# Altium schematic sheet 26_Clocks_2.SchDoc: Clocks 2
size A3; Organization: Lime Microsystems; Address1: Surrey Tech Centre; Address2: Guildford GU2 7YG; Address3: Surrey; Address4: United Kingdom; Revision: v1.2; SheetNumber: 24; SheetTotal: 27
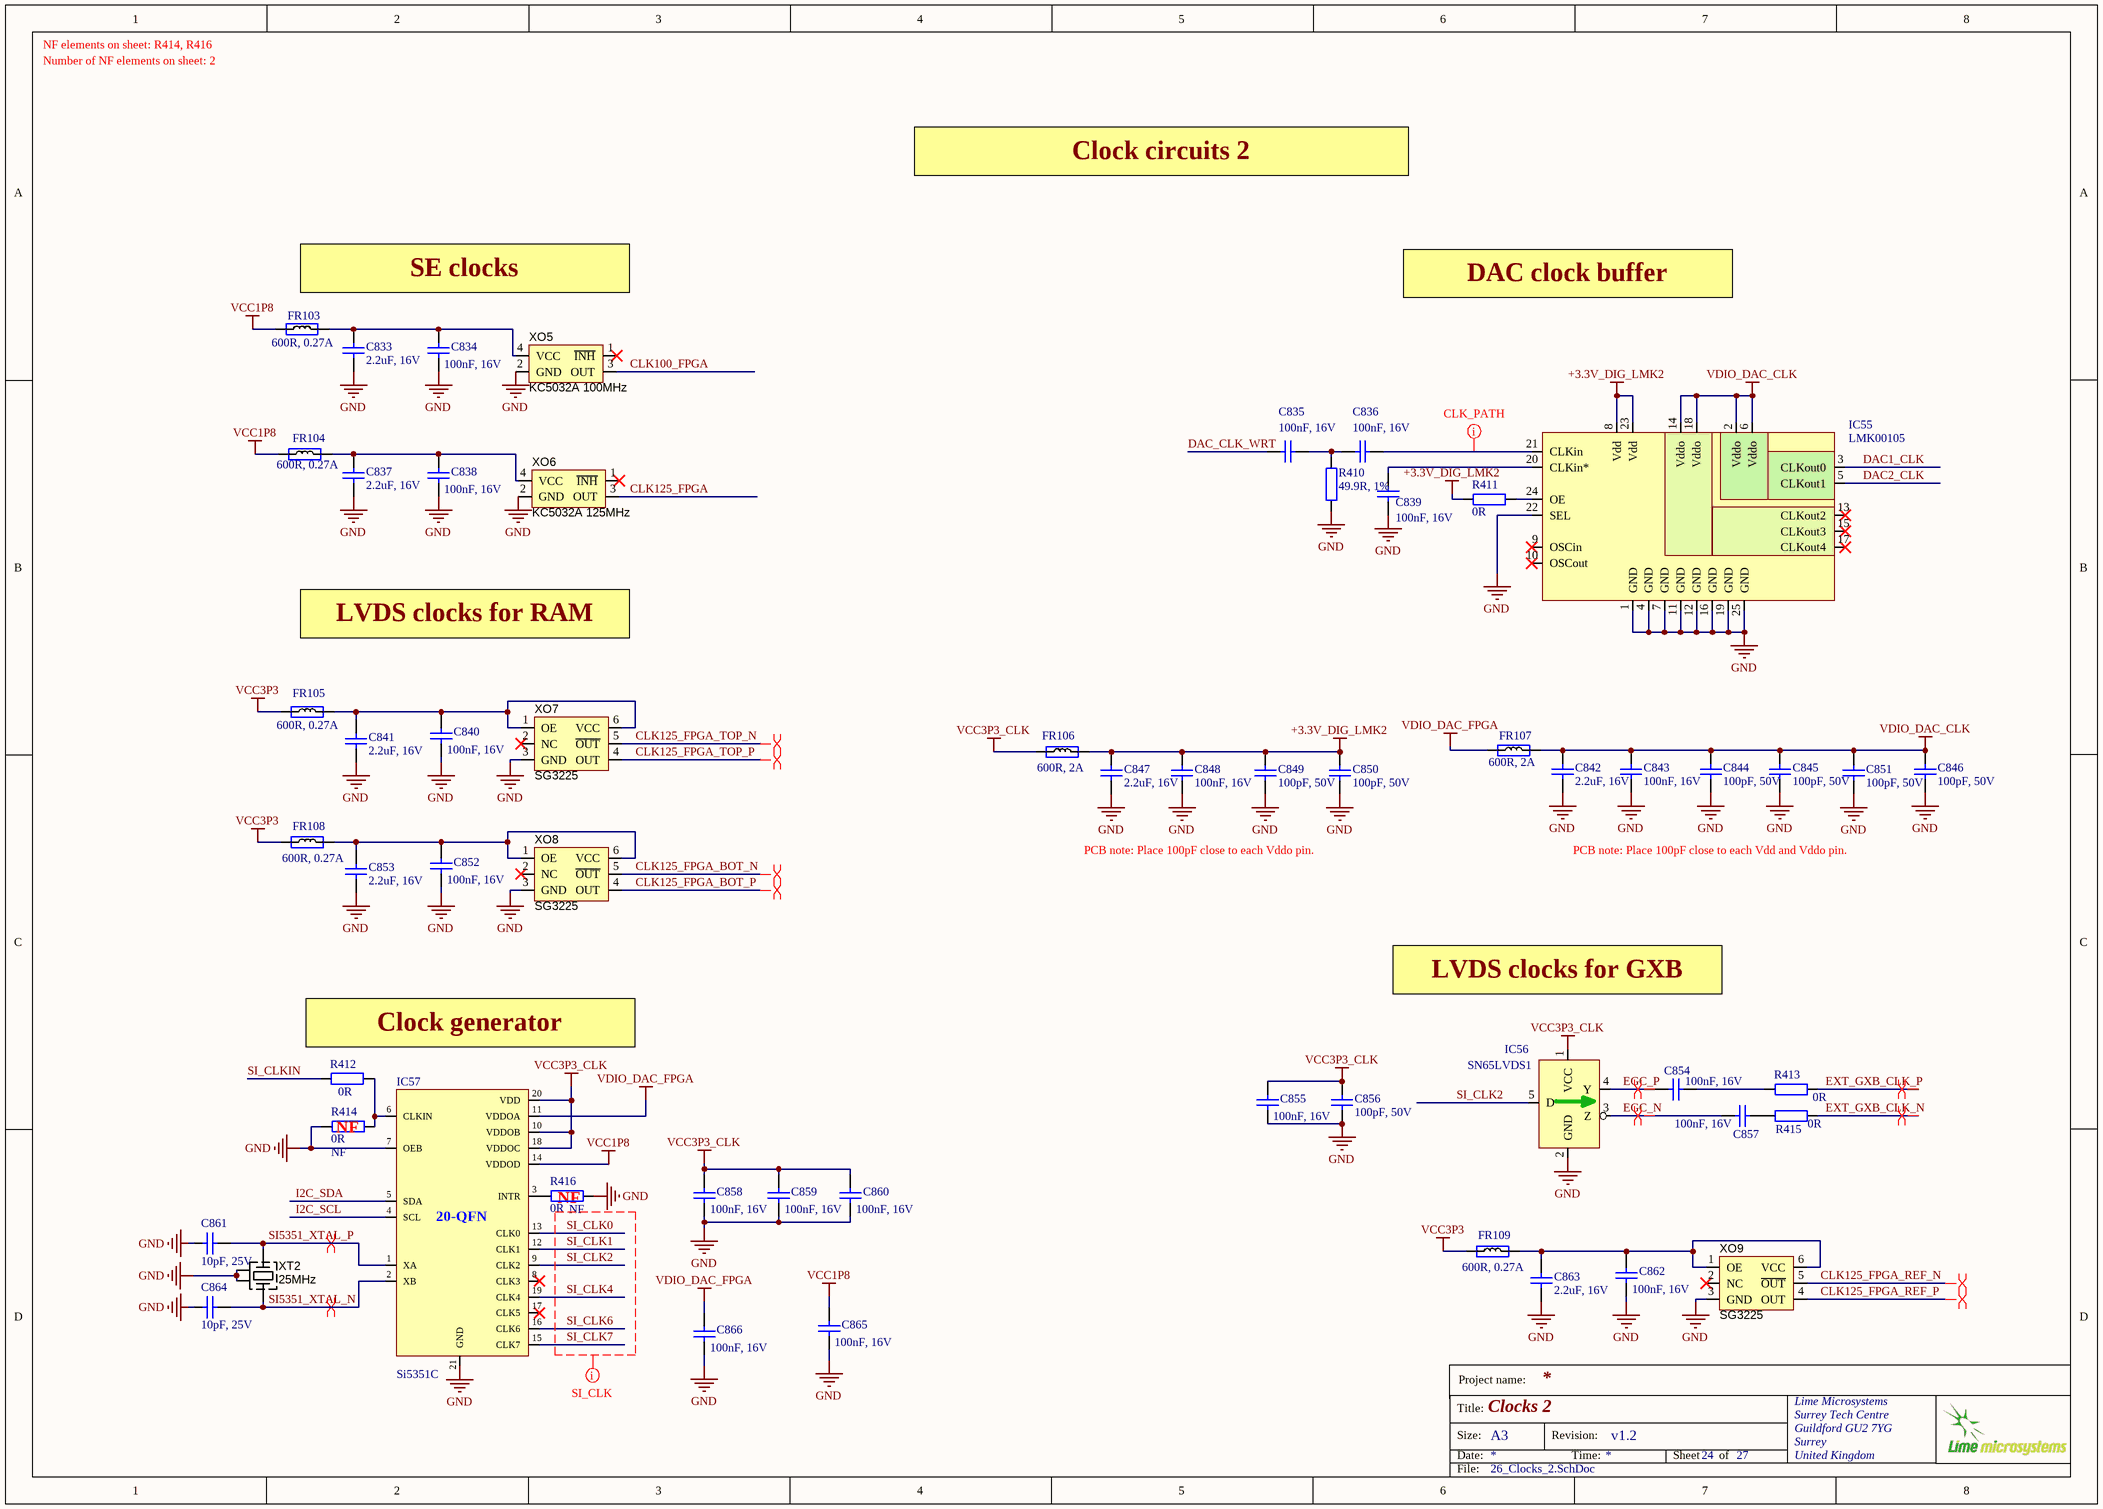
[diagram p0: 26_Clocks_2.SchDoc]

## Parts
C833  2.2uF, 16V  [CAP0402]
C834  100nF, 16V  [CAP0402]
C835  100nF, 16V  [CAP0402]
C836  100nF, 16V  [CAP0402]
C837  2.2uF, 16V  [CAP0402]
C838  100nF, 16V  [CAP0402]
C839  100nF, 16V  [CAP0402]
C840  100nF, 16V  [CAP0402]
C841  2.2uF, 16V  [CAP0402]
C842  2.2uF, 16V  [CAP0402]
C843  100nF, 16V  [CAP0402]
C844  100pF, 50V  [CAP0402]
C845  100pF, 50V  [CAP0402]
C846  100pF, 50V  [CAP0402]
C847  2.2uF, 16V  [CAP0402]
C848  100nF, 16V  [CAP0402]
C849  100pF, 50V  [CAP0402]
C850  100pF, 50V  [CAP0402]
C851  100pF, 50V  [CAP0402]
C852  100nF, 16V  [CAP0402]
C853  2.2uF, 16V  [CAP0402]
C854  100nF, 16V  [CAP0402]
C855  100nF, 16V  [CAP0402]
C856  100pF, 50V  [CAP0402]
C857  100nF, 16V  [CAP0402]
C858  100nF, 16V  [CAP0402]
C859  100nF, 16V  [CAP0402]
C860  100nF, 16V  [CAP0402]
C861  10pF, 25V  [CAP0402]
C862  100nF, 16V  [CAP0402]
C863  2.2uF, 16V  [CAP0402]
C864  10pF, 25V  [CAP0402]
C865  100nF, 16V  [CAP0402]
C866  100nF, 16V  [CAP0402]
FR103  value 600R, 0.27A  [RES0201]  (hidden comment: Ferrite)
FR104  value 600R, 0.27A  [RES0201]  (hidden comment: Ferrite)
FR105  value 600R, 0.27A  [RES0201]  (hidden comment: Ferrite)
FR106  600R, 2A  [RES0805]
FR107  600R, 2A  [RES0805]
FR108  value 600R, 0.27A  [RES0201]  (hidden comment: Ferrite)
FR109  value 600R, 0.27A  [RES0201]  (hidden comment: Ferrite)
IC55  LMK00105  [LMK00105SQ]
IC56  SN65LVDS1  [SOT23-5]
IC57  Si5351C  [Si5351C_20QFN]
R410  49.9R, 1%  [RES0402]
R411  0R  [RES0402]
R412  0R  [RES0402]
R413  0R  [RES0402]
R414  0R  Assembly Info: NF  [RES0402]
R415  0R  [RES0402]
R416  0R  Assembly Info: NF  [RES0402]
XO5  KC5032A 100MHz  [CRYSTAL_4-LCC_v4]
XO6  KC5032A 125MHz  [CRYSTAL_4-LCC_v4]
XO7  SG3225  [CRYSTAL_6-LCC]
XO8  SG3225  [CRYSTAL_6-LCC]
XO9  SG3225  [CRYSTAL_6-LCC]
XT2  25MHz  [CRYSTAL_4-LCC]

## Nets
+3.3V_DIG_LMK2: C847.2 C848.2 C849.2 C850.2 FR106.2 IC55.8(Vdd) IC55.23(Vdd) R411.1
GND: C833.1 C834.2 C837.1 C838.2 C839.1 C840.2 C841.1 C842.1 C843.1 C844.1 C845.1 C846.1 C847.1 C848.1 C849.1 C850.1 C851.1 C852.2 C853.1 C855.2 C856.1 C858.2 C859.2 C860.2 C861.1 C862.2 C863.1 C864.1 C865.2 C866.2 IC55.1(GND) IC55.4(GND) IC55.7(GND) IC55.11(GND) IC55.12(GND) IC55.16(GND) IC55.19(GND) IC55.22(SEL) IC55.25(GND) IC56.2(GND) IC57.7(OEB) IC57.21(GND) R410.1 R414.2 R416.1 XO5.2(GND) XO6.2(GND) XO7.3(GND) XO8.3(GND) XO9.3(GND) XT2.2(GND) XT2.4(GND)
VCC1P8: C865.1 FR103.1 FR104.1 IC57.14(VDDOD)
VCC3P3: FR105.1 FR108.1 FR109.1
VCC3P3_CLK: C855.1 C856.2 C858.1 C859.1 C860.1 FR106.1 IC56.1(VCC) IC57.10(VDDOB) IC57.18(VDDOC) IC57.20(VDD)
VDIO_DAC_CLK: C842.2 C843.2 C844.2 C845.2 C846.2 C851.2 FR107.2 IC55.2(Vddo) IC55.6(Vddo) IC55.14(Vddo) IC55.18(Vddo)
VDIO_DAC_FPGA: C866.1 FR107.1 IC57.11(VDDOA)
CLK100_FPGA: XO5.3(OUT)
CLK125_FPGA: XO6.3(OUT)
CLK125_FPGA_BOT_N: XO8.5(~{OUT})
CLK125_FPGA_BOT_P: XO8.4(OUT)
CLK125_FPGA_REF_N: XO9.5(~{OUT})
CLK125_FPGA_REF_P: XO9.4(OUT)
CLK125_FPGA_TOP_N: XO7.5(~{OUT})
CLK125_FPGA_TOP_P: XO7.4(OUT)
DAC1_CLK: IC55.3(CLKout0)
DAC2_CLK: IC55.5(CLKout1)
DAC_CLK_WRT: C835.2
EGC_N: C857.1 IC56.3(Z)
EGC_P: C854.1 IC56.4(Y)
EXT_GXB_CLK_N: R415.1
EXT_GXB_CLK_P: R413.1
I2C_SCL: IC57.4(SCL)
I2C_SDA: IC57.5(SDA)
SI5351_XTAL_N: C864.2 IC57.2(XB) XT2.3(X)
SI5351_XTAL_P: C861.2 IC57.1(XA) XT2.1(X)
SI_CLK0: IC57.13(CLK0)
SI_CLK1: IC57.12(CLK1)
SI_CLK2: IC56.5(D) IC57.9(CLK2)
SI_CLK4: IC57.19(CLK4)
SI_CLK6: IC57.16(CLK6)
SI_CLK7: IC57.15(CLK7)
SI_CLKIN: R412.1
NetC833_2: C833.2 C834.1 FR103.2 XO5.4(VCC)
NetC835_1: C835.1 C836.2 R410.2
NetC836_1: C836.1 IC55.21(CLKin)
NetC837_2: C837.2 C838.1 FR104.2 XO6.4(VCC)
NetC839_2: C839.2 IC55.20(CLKin*)
NetC840_1: C840.1 C841.2 FR105.2 XO7.1(OE) XO7.6(VCC)
NetC852_1: C852.1 C853.2 FR108.2 XO8.1(OE) XO8.6(VCC)
NetC854_2: C854.2 R413.2
NetC857_2: C857.2 R415.2
NetC862_1: C862.1 C863.2 FR109.2 XO9.1(OE) XO9.6(VCC)
NetIC55_24: IC55.24(OE) R411.2
NetIC57_3: IC57.3(INTR) R416.2
NetIC57_6: IC57.6(CLKIN) R412.2 R414.1

Not connected (* = marked no-connect by the designer): IC55 9(OSCin)* 10(OSCout)* 13(CLKout2)* 15(CLKout3)* 17(CLKout4)*; IC57 8(CLK3)* 17(CLK5)*; XO5 1(~{INH})*; XO6 1(~{INH})*; XO7 2(NC)*; XO8 2(NC)*; XO9 2(NC)*

## Layout directives
net class SI_CLK: SI_CLK0, SI_CLK1, SI_CLK2, SI_CLK4, SI_CLK6, SI_CLK7
differential pair: CLK125_FPGA_BOT_N, CLK125_FPGA_BOT_P, CLK125_FPGA_REF_N, CLK125_FPGA_REF_P, CLK125_FPGA_TOP_N, CLK125_FPGA_TOP_P, EGC_N, EGC_P, EXT_GXB_CLK_N, EXT_GXB_CLK_P, SI5351_XTAL_N, SI5351_XTAL_P
net class CLK_PATH: NetC836_1

## Notes on the sheet
- NF elements on sheet: R414, R416
- Number of NF elements on sheet: 2
- Clock circuits 2
- SE clocks
- DAC clock buffer
- LVDS clocks for RAM
- PCB note: Place 100pF close to each Vddo pin.
- PCB note: Place 100pF close to each Vdd and Vddo pin.
- LVDS clocks for GXB
- (near R412) Clock generator
- (near R414) NF
- (near R416) NF
- Project name:
- Title:
- Size:
- Date:
- A3
- Revision:
- Time:
- Sheet
- of
- File:
- (in symbol Si5351C) 20-QFN

## Library data of the parts
C833 C837 C841 C842 C847 C853 C863 = Cap_0402: CAP CER 2.2UF 16V 10% X5R 0402; Manufacturer Part Number 1: C1005X5R1C225K050BC; Manufacturer: TDK Corporation; Part Description: 2.2µF ±10% 16V Ceramic Capacitor X5R 0402 (1005 Metric); Capacitance: 2.2µF; Tolerance: ±20%; Capacitor Case Style: 0402 [1005 Metric]; Value: 2.2uF, 16V; Supplier 1: Digi-Key; Supplier Part Number 1: 445-9085-6-ND; Category: Capacitors; Voltage - Rated: 16V; Thickness (Max): 0.022" (0.55mm); Applications: General Purpose; Package / Case: 0402 (1005 Metric); Size / Dimension: 0.039" L x 0.020" W (1.00mm x 0.50mm); Features: -; Temperature Coefficient: X5R; Mounting Type: Surface Mount, MLCC; Ratings: -; Lead Style: -; Operating Temperature: -55°C ~ 85°C; Lead Spacing: -; RoHS: RoHS Compliant; Height - Seated (Max): -; Packaging: Tape & Reel (TR); Operating Temperature Range: -55°C to +85
C834 C838 C840 C852 C854 C855 C857-C860 C862 C865 C866 = Cap_0603: Manufacturer Part Number 1: GRM155R71C104KA88D; Part Description: 0.10µF ±10% 16V Ceramic Capacitor X7R 0402 (1005 Metric); Brand: Murata Electronics; Tolerance: 10 %; Type: General Purpose MLCC; Capacitance: 0.1 uF; Temperature Coefficient / Code: +/- 15 %; Case Height: 0.5 mm; Case Length: 1 mm; Dielectric: X7R; Supplier 1: Mouser; Supplier Part Number 1: 81-GRM155R71C104KA88; Case Code - in: 0402; Manufacturer: Murata Electronics; Category: Multilayer Ceramic Capacitors MLCC - SMD/SMT; Voltage Rating DC: 16 V; Value: 100nF, 16V; Manufacturer Part Number: GRM155R71C104KA88D; Case Code - mm: 1005; Case Width: 0.5 mm; Maximum Operating Temperature: + 125 C; Minimum Operating Temperature: - 55 C; Minimum Order Quantity: 1; Operating Temperature Range: - 55 C to + 125 C; Package / Case: 0402 (1005 metric); Packaging: Reel; Product: General Type MLCCs; Product Category: Low & Medium Capacitance SMD Ceramic Chip Capacitors; Reeling: True; RoHS - Mouser: Y; RoHS: RoHS Compliant; Series: GRM; Standard Pack Qty: 10000; Termination Style: SMD/SMT
C835 C836 C839 C843 C848 = Cap_0402: Manufacturer: Murata Electronics; Manufacturer Part Number: GRM155R71C104KA88D; Part Description: 0.10µF ±10% 16V Ceramic Capacitor X7R 0402 (1005 Metric); Tolerance: 10 %; Type: General Purpose MLCC; Capacitance: 0.1 uF; Case Length: 1 mm; Dielectric: X7R; Case Height: 0.5 mm; Temperature Coefficient / Code: +/- 15 %; Value: 100nF, 16V; Supplier 1: Mouser; Supplier Part Number 1: 81-GRM155R71C104KA88; Case Code - in: 0402; RoHS: RoHS Compliant; Operating Temperature Range: - 55 C to + 125 C; Series: GRM; Termination Style: SMD/SMT; Package / Case: 0402 (1005 metric); Voltage Rating DC: 16 V; Maximum Operating Temperature: + 125 C; Case Code - mm: 1005; Minimum Operating Temperature: - 55 C; Product Category: Low & Medium Capacitance SMD Ceramic Chip Capacitors; Packaging: Reel; Product: General Type MLCCs; Category: Multilayer Ceramic Capacitors MLCC - SMD/SMT; Brand: Murata Electronics; Case Width: 0.5 mm; RoHS - Mouser: Y; Standard Pack Qty: 10000; Minimum Order Quantity: 1; Reeling: True; Manufacturer Part Number 1: GRM155R71C104KA88D
C844-C846 C849-C851 C856 = Cap_0402: Manufacturer Part Number 1: CC0402JRNPO9BN101; Manufacturer: Yageo; Part Description: 100pF ±5% 50V C0G, NP0 Ceramic Capacitor -55°C ~ 125°C Surface Mount, MLCC 0402 (1005 Metric) 0.039" L x 0.020" W (1.00mm x 0.50mm); Temperature Coefficient: C0G, NP0; Tolerance: ±5%; Value: 100pF, 50V; Supplier 1: Digi-Key; Supplier Part Number 1: 311-1024-1-ND; RoHS: RoHS Compliant; Category: Capacitors; Applications: General Purpose; Mounting Type: Surface Mount, MLCC; Capacitance: 100pF; Ratings: -; Packaging: Cut Tape (CT); Voltage - Rated: 50V; Size / Dimension: 0.039" L x 0.020" W (1.00mm x 0.50mm); Height - Seated (Max): -; Package / Case: 0402 (1005 Metric); Operating Temperature: -55°C ~ 125°C; Features: -; Lead Spacing: -; Lead Style: -; Thickness (Max): 0.022" (0.55mm)
C861 C864 = Cap_0402: Manufacturer: AVX; Part Description: 10pF ±5% 25V Ceramic Capacitor C0G, NP0 0402 (1005 Metric); Manufacturer Part Number 1: 04023A100JAT2A; Capacitance: 10; Ceramic Capacitor Case: 0402 [1005 Metric]; Capacitance Tolerance: ± 5%; Supplier 1: Farnell; Supplier Part Number 1: 2332478RL; value: 10pF, 25V
FR103-FR105 FR108 FR109 = Ferrite: Manufacturer Part Number 1: BK0603TS601-T; Manufacturer: Taiyo Yuden; Part Description: FERRITE BEAD 600 OHM 0201 1LN; DC Resistance (DCR): 750 mOhm Max; Filter Type: Differential Mode - Single; Impedance @ Frequency: 600 Ohm @ 100MHz; Current Rating: 270mA; Supplier 1: Digi-Key; Supplier Part Number 1: 587-3277-1-ND; Size / Dimension: 0.024" L x 0.012" W (0.60mm x 0.30mm); Package / Case: 0201 (0603 Metric); Height (Max): 0.013" (0.33mm); Mounting Type: Surface Mount; Packaging: Cut Tape (CT); RoHS: RoHS Compliant; Category: Filters
FR106 FR107 = Ferrite: Manufacturer Part Number 1: MPZ2012S601A; Manufacturer: TDK; Part Description: FERRITE BEAD 600 OHM 0805 1LN; Filter Type: Differential Mode - Single; Impedance @ Frequency: 600 Ohm @ 100MHz; DC Resistance (DCR): 100 mOhm Max; DC Current Rating: 2; DC Resistance Max: 0.1; Ferrite Case Style: 0805 [2012 Metric]; Ferrite Mounting: SMD; Impedance @ 100MHz: 600; Impedance Tolerance: ± 25%; Supplier 1: Farnell; Supplier Part Number 1: 1669753RL; Mounting Type: Surface Mount; RoHS: RoHS Compliant; Height (Max): 0.041" (1.05mm); Packaging: Tape & Reel (TR); Category: Filters; Current Rating: 2A; Package / Case: 0805 (2012 Metric); Size / Dimension: 0.079" L x 0.049" W (2.00mm x 1.25mm); Value: 600R, 2A; Core Material: Ferrite; Supplier: Farnell
IC55 = LMK00105: Manufacturer: Texas Instruments; Manufacturer Part Number 1: LMK00105SQ/NOPB; Part Description: Clock Fanout Buffer (Distribution), Multiplexer, Translator IC 200MHz 24-WFQFN Exposed Pad; Frequency - Max: 200MHz; Voltage - Supply: 2.375 V ~ 3.45 V; Input: HCSL, LVCMOS, LVDS, LVPECL, LVTTL, SSTL, Crystal; Differential - Input:Output: Yes/No; Supplier 1: Digi-Key; Type: Fanout Buffer (Distribution), Multiplexer, Translator; Category: Integrated Circuits (ICs); Operating Temperature: -40°C ~ 85°C; Package / Case: 24-WFQFN Exposed Pad; Supplier Device Package: 24-WQFN (4x4); Supplier Part Number 1: LMK00105SQ/NOPBCT-ND
IC56 = SN65LVDS1: Manufacturer: TEXAS INSTRUMENTS; Manufacturer Part Number 1: SN65LVDS1DBVR; Part Description: DIFFERENTIAL LINE DRIVER/RECEIVER SIGNAL SOT23-5; Supply Voltage Min: 2.4; Supply Voltage Max: 3.6; No. of Pins: 5; Driver Case Style: SOT-23; Supplier 1: Newark; Supplier Part Number 1: 76C0715
IC57 = Si5351C: Manufacturer: Silicon Labs; Manufacturer Part Number 1: SI5351C-B-GM; Part Description: IC CLK GENERATOR 200MHZ 20QFN; Output: LVCMOS; Ratio - Input:Output: 2:8; Input: Clock, Crystal; Voltage - Supply: 1.71 V ~ 3.6 V; Differential - Input:Output: No/No; Divider/Multiplier: Yes/No; Frequency - Max: 160MHz; PLL: Yes; Number of Circuits: 1; Supplier 1: Digi-Key; Supplier Part Number 1: 336-2402-ND; Mounting Type: Surface Mount; Supplier Device Package: 20-QFN (4x4); Category: Integrated Circuits (ICs); RoHS: RoHS Compliant; Package / Case: 20-VFQFN Exposed Pad; Packaging: Tray; Type: Clock Generator; Operating Temperature: -40°C ~ 85°C
R410 = Res_0402: Manufacturer: Samsung Electro-Mechanics America, Inc.; Part Description: RES SMD 49.9 OHM 1% 1/16W 0402; Manufacturer Part Number 1: RC1005F49R9CS; Temperature Coefficient: ±100ppm/°C; Resistance (Ohms): 49.9; Power (Watts): 0.063W, 1/16W; Number of Terminations: 2; Size / Dimension: 0.039" L x 0.020" W (1.00mm x 0.50mm); Supplier Device Package: 0402 (1005 Metric); RoHS: RoHS Compliant; Supplier Part Number 1: 1276-3469-6-ND; Features: -; Packaging: Digi-Reel®; Tolerance: ±1%; Height: 0.016" (0.40mm); Category: Resistors; Composition: Thick Film; Package / Case: 0402 (1005 Metric); Supplier 1: Digi-Key; Operating Temperature: -55°C ~ 155°C; Value: 49.9R, 1%
R411-R416 = Res_0402: Manufacturer Part Number 1: RC0402JR-070RL; Manufacturer: Yageo; Part Description: RES SMD 0.0OHM JUMPER 1/16W 0402; Resistance (Ohms): 0.0; Tolerance: Jumper; Power (Watts): 0.063W, 1/16W; Value: 0R; Supplier 1: Digi-Key; Supplier Part Number 1: 311-0.0JRTR-ND; Category: Resistors; Temperature Coefficient: -; Features: Moisture Resistant; Supplier Device Package: 0402; Height: 0.016" (0.40mm); Package / Case: 0402 (1005 Metric); Operating Temperature: -55°C ~ 155°C; Size / Dimension: 0.039" L x 0.020" W (1.00mm x 0.50mm); Composition: Thick Film; Packaging: Tape & Reel (TR); Number of Terminations: 2; RoHS: RoHS Compliant
XO5 = CRYSTAL: Oscillator Crystal; Manufacturer: AVX Corp/Kyocera Corp; Manufacturer Part Number 1: KC5032A100.000C1GE00; Part Description: 100MHz CMOS XO (Standard) Oscillator Surface Mount 1.6 V ~ 3.63 V 19mA Standby (Power Down); Frequency Stability: ±50ppm; Current - Supply (Max): 19mA; Voltage - Supply: 1.8V, 2.5V, 3.3V; Function: Standby (Power Down); Current - Supply (Disable) (Max): 10µA; Output: CMOS; Supplier 1: Digi-Key; Supplier Part Number 1: 1253-1302-1-ND; Frequency: 100MHz; RoHS: RoHS Compliant; Package / Case: 4-SMD, No Lead (DFN, LCC); Category: Crystals and Oscillators; Packaging: Cut Tape (CT); Height: 0.039" (1.00mm); Size / Dimension: 0.197" L x 0.126" W (5.00mm x 3.20mm); Operating Temperature: -40°C ~ 85°C; Mounting Type: Surface Mount; Ratings: -; Type: XO (Standard)
XO6 = CRYSTAL: Oscillator Crystal; Manufacturer Part Number 1: KC5032A125.000C1GE00; Manufacturer: AVX Corp/Kyocera Corp; Part Description: 125MHz CMOS XO (Standard) Oscillator Surface Mount 1.6 V ~ 3.63 V 22mA Standby (Power Down); Voltage - Supply: 1.8V, 2.5V, 3.3V; Current - Supply (Max): 22mA; Output: CMOS; Frequency Stability: ±50ppm; Function: Standby (Power Down); Current - Supply (Disable) (Max): 10µA; Supplier 1: Digi-Key; Supplier Part Number 1: 1253-1304-1-ND; Height: 0.039" (1.00mm); RoHS: RoHS Compliant; Size / Dimension: 0.197" L x 0.126" W (5.00mm x 3.20mm); Mounting Type: Surface Mount; Packaging: Cut Tape (CT); Category: Crystals and Oscillators; Operating Temperature: -40°C ~ 85°C; Package / Case: 4-SMD, No Lead (DFN, LCC); Frequency: 125MHz; Ratings: -; Type: XO (Standard)
XO7 = CRYSTAL_SG3225: Oscillator Crystal; Manufacturer Part Number 1: SG3225VAN 125.000000M-KEGA3; Manufacturer: EPSON; Part Description: 125MHz LVDS XO (Standard) Oscillator Surface Mount 2.5 V ~ 3.3 V 30mA Enable/Disable; Frequency: 125MHz; Current - Supply (Disable) (Max): 20mA; Frequency Stability: ±30ppm; Function: Tri-State (Output Enable); Output: LVDS; Current - Supply (Max): 30mA; Voltage - Supply: 2.5 V ~ 3.3 V; Supplier 1: Digi-Key; Supplier Part Number 1: SER3930CT-ND; RoHS: RoHS Compliant; Packaging: Cut Tape (CT); Package / Case: 6-SMD, No Lead (DFN, LCC); Category: Crystals and Oscillators; Mounting Type: Surface Mount; Type: XO (Standard); Height: 0.047" (1.20mm); Size / Dimension: 0.126" L x 0.098" W (3.20mm x 2.50mm); Ratings: -; Operating Temperature: -40°C ~ 85°C
XO8 = CRYSTAL_SG3225: Oscillator Crystal; Manufacturer: EPSON; Manufacturer Part Number 1: SG3225VAN 125.000000M-KEGA3; Part Description: 125MHz LVDS XO (Standard) Oscillator Surface Mount 2.5 V ~ 3.3 V 30mA Enable/Disable; Function: Tri-State (Output Enable); Current - Supply (Max): 30mA; Output: LVDS; Current - Supply (Disable) (Max): 20mA; Frequency Stability: ±30ppm; Voltage - Supply: 2.5 V ~ 3.3 V; Frequency: 125MHz; Supplier 1: Digi-Key; Supplier Part Number 1: SER3930CT-ND; Operating Temperature: -40°C ~ 85°C; Packaging: Cut Tape (CT); Mounting Type: Surface Mount; Type: XO (Standard); RoHS: RoHS Compliant; Height: 0.047" (1.20mm); Category: Crystals and Oscillators; Ratings: -; Package / Case: 6-SMD, No Lead (DFN, LCC); Size / Dimension: 0.126" L x 0.098" W (3.20mm x 2.50mm)
XO9 = CRYSTAL_SG3225: Oscillator Crystal; Manufacturer: EPSON; Manufacturer Part Number 1: SG3225VAN 125.000000M-KEGA3; Part Description: 125MHz LVDS XO (Standard) Oscillator Surface Mount 2.5 V ~ 3.3 V 30mA Enable/Disable; Current - Supply (Max): 30mA; Frequency: 125MHz; Current - Supply (Disable) (Max): 20mA; Frequency Stability: ±30ppm; Voltage - Supply: 2.5 V ~ 3.3 V; Output: LVDS; Function: Tri-State (Output Enable); Supplier 1: Digi-Key; Supplier Part Number 1: SER3930CT-ND; Type: XO (Standard); Category: Crystals and Oscillators; Height: 0.047" (1.20mm); Operating Temperature: -40°C ~ 85°C; Ratings: -; Package / Case: 6-SMD, No Lead (DFN, LCC); Packaging: Tape & Reel (TR); RoHS: RoHS Compliant; Size / Dimension: 0.126" L x 0.098" W (3.20mm x 2.50mm); Mounting Type: Surface Mount
XT2 = CRYSTAL_19M2: Oscillator Crystal 25 MHz; Manufacturer Part Number 1: ABM8-25.000MHZ-B2-T; Manufacturer: ABRACON; Part Description: 25MHz ±20ppm Crystal 18pF 50 Ohm -20°C ~ 70°C Surface Mount 4-SMD, No Lead (DFN, LCC; Supplier 1: Newark; Supplier Part Number 1: 13J1767